# EAGLE design scc (EAGLE 7.2.0)
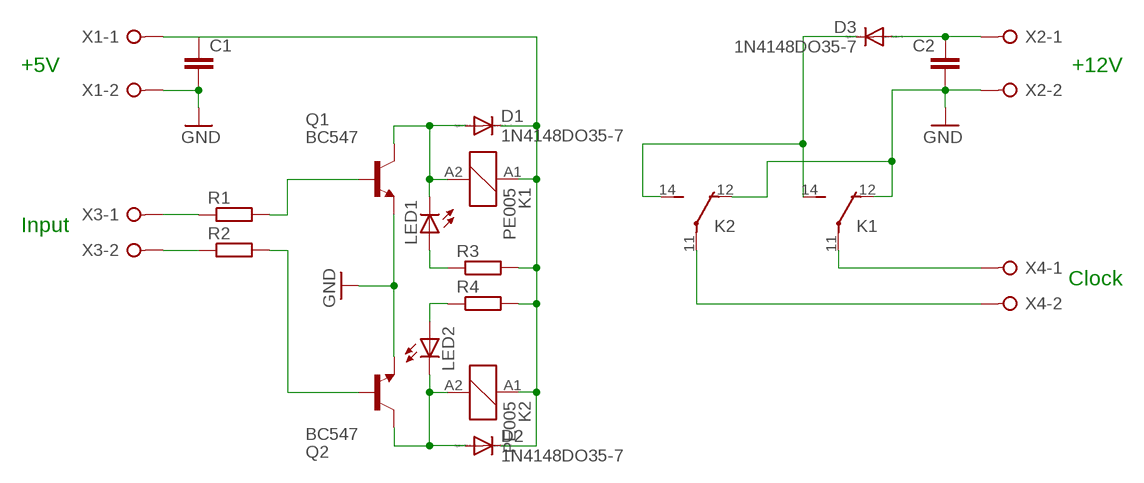
[diagram p0: schematic, sheet 1]

## Parts
C1  C-EU050-024X044  [C050-024X044]
C2  C-EU050-024X044  [C050-024X044]
D1  1N4148DO35-7  [DO35-7]
D2  1N4148DO35-7  [DO35-7]
D3  1N4148DO35-7  [DO35-7]
K1  PE005  [PE]
K2  PE005  [PE]
LED1  LED3MM  [LED3MM]
LED2  LED3MM  [LED3MM]
Q1  BC547  [TO92]
Q2  BC547  [TO92]
R1  R-EU_0204/7  [0204/7]
R2  R-EU_0204/7  [0204/7]
R3  R-EU_0204/7  [0204/7]
R4  R-EU_0204/7  [0204/7]
X1  W237-02P  [W237-132]
X2  W237-02P  [W237-132]
X3  W237-02P  [W237-132]
X4  W237-02P  [W237-132]

## Nets
GND: C1.2 C2.2 K1.12(2:O) K2.12(2:O) Q1.1(E) Q2.1(E) X1.2 X2.2
N$1: C2.1 D3.A X2.1
N$2: R1.1 X3.1
N$3: K1.11(2:P) X4.1
N$4: R2.1 X3.2
N$5: K2.11(2:P) X4.2
N$6: Q1.2(B) R1.2
N$7: D1.A K1.A2 LED1.K(C) Q1.3(C)
N$8: D2.A K2.A2 LED2.K(C) Q2.3(C)
N$9: C1.1 D1.C D2.C K1.A1 K2.A1 R3.2 R4.2 X1.1
N$10: LED1.A R3.1
N$11: Q2.2(B) R2.2
N$12: D3.C K1.14(2:S) K2.14(2:S)
N$13: LED2.A R4.1

## Notes on the sheet
- +5V | +12V
- Input
- Clock

## Library data of the parts
C1 C2 = rcl:C-EU: CAPACITOR, European symbol
D1-D3 = diode:1N4148: DIODE high speed (Philips)
K1 K2 = relay:PE*: Miniature PCB Relay 1 pole 5 A SCHRACK Source: http://www.schrack.com/.. 5807.pdf Miniature PCB Relay bistable 1pole 5 A, polarized bistable version Source: http://www.schrack.com/.. 5808.pdf; OC_FARNELL: unknown; OC_NEWARK: unknown
LED1 LED2 = led:LED: LED OSRAM: - CHIPLED LG R971, LG N971, LY N971, LG Q971, LY Q971, LO R971, LY R971 LH N974, LH R974 LS Q976, LO Q976, LY Q976 LO Q996 - Hyper CHIPLED LW Q18S LB Q993, LB Q99A, LB R99A - SideLED LS A670, LO A670, LY A670, LG A670, LP A670 LB A673, LV A673, LT A673, LW A673 LH A674 LY A675 LS A676, LA A676, LO A676, LY A676, LW A676 LS A679, LY A679, LG A679 - Hyper Micro SIDELED® LS Y876, LA Y876, LO Y876, LY Y876 LT Y87S - SmartLED LW L88C, LW L88S LB L89C, LB L89S, LG L890 LS L89K, LO L89K, LY L89K LS L896, LA L896, LO L896, LY L896 - TOPLED LS T670, LO T670, LY T670, LG T670, LP T670 LSG T670, LSP T670, LSY T670, LOP T670, LYG T670 LG T671, LOG T671, LSG T671 LB T673, LV T673, LT T673, LW T673 LH T674 LS T676, LA T676, LO T676, LY T676, LB T676, LH T676, LSB T676, LW T676 LB T67C, LV T67C, LT T67C, LS T67K, LO T67K, LY T67K, LW E67C LS E67B, LA E67B, LO E67B, LY E67B, LB E67C, LV E67C, LT E67C LW T67C LS T679, LY T679, LG T679 LS T770, LO T770, LY T770, LG T770, LP T770 LB T773, LV T773, LT T773, LW T773 LH T774 LS E675, LA E675, LY E675, LS T675 LS T776, LA T776, LO T776, LY T776, LB T776 LHGB T686 LT T68C, LB T68C - Hyper Mini TOPLED® LB M676 - Mini TOPLED Santana® LG M470 LS M47K, LO M47K, LY M47K Source: http://www.osram.convergy.de LUXEON: - LUMILED® LXK2-PW12-R00, LXK2-PW12-S00, LXK2-PW14-U00, LXK2-PW14-V00 LXK2-PM12-R00, LXK2-PM12-S00, LXK2-PM14-U00 LXK2-PE12-Q00, LXK2-PE12-R00, LXK2-PE12-S00, LXK2-PE14-T00, LXK2-PE14-U00 LXK2-PB12-K00, LXK2-PB12-L00, LXK2-PB12-M00, LXK2-PB14-N00, LXK2-PB14-P00, LXK2-PB14-Q00 LXK2-PR12-L00, LXK2-PR12-M00, LXK2-PR14-Q00, LXK2-PR14-R00 LXK2-PD12-Q00, LXK2-PD12-R00, LXK2-PD12-S00 LXK2-PH12-R00, LXK2-PH12-S00 LXK2-PL12-P00, LXK2-PL12-Q00, LXK2-PL12-R00 Source: www.luxeon.com KINGBRIGHT: KA-3528ASYC Source: www.kingbright.com
Q1 Q2 = transistor-npn:BC547*: NPN Transistor
R1-R4 = rcl:R-EU_: RESISTOR, European symbol
X1-X4 = con-wago-508:W237-02P: WAGO SREW CLAMP; OC_FARNELL: unknown; OC_NEWARK: unknown

## Board
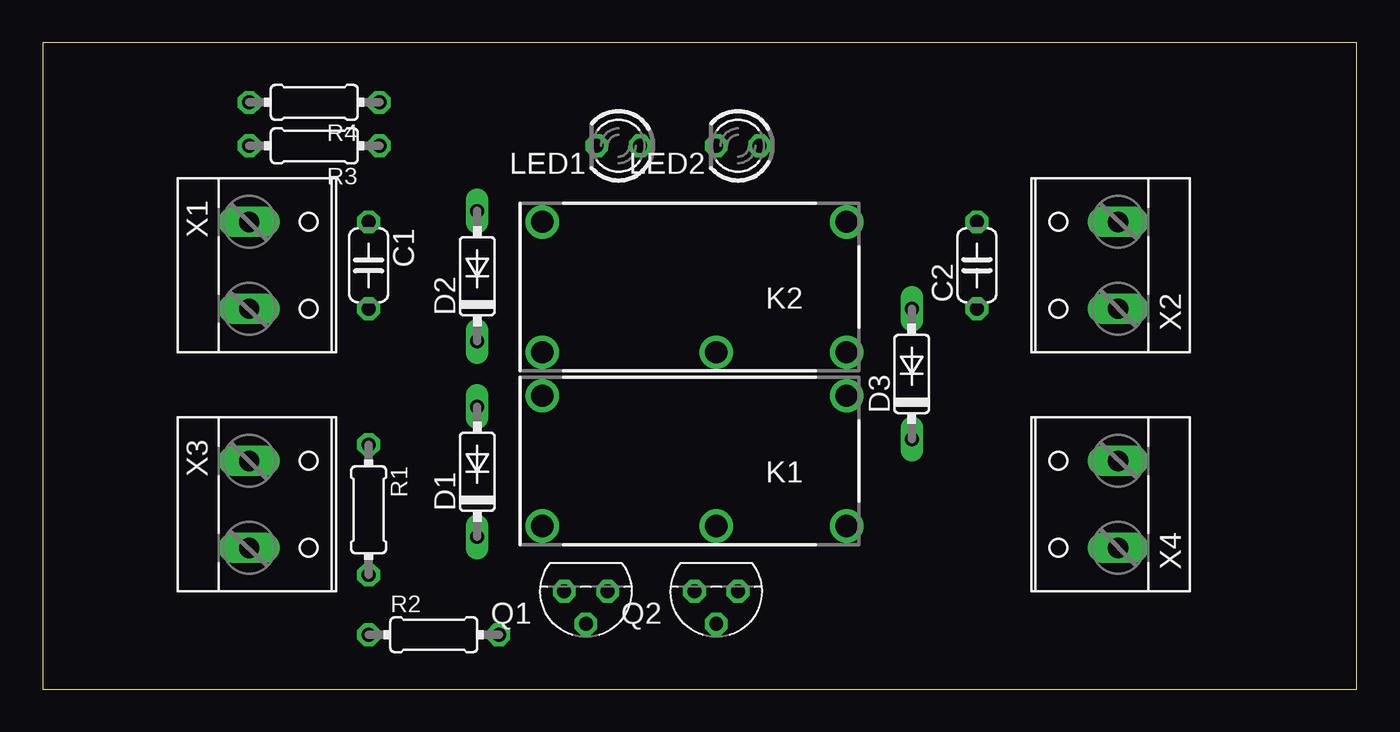
[diagram p1: board, top side]
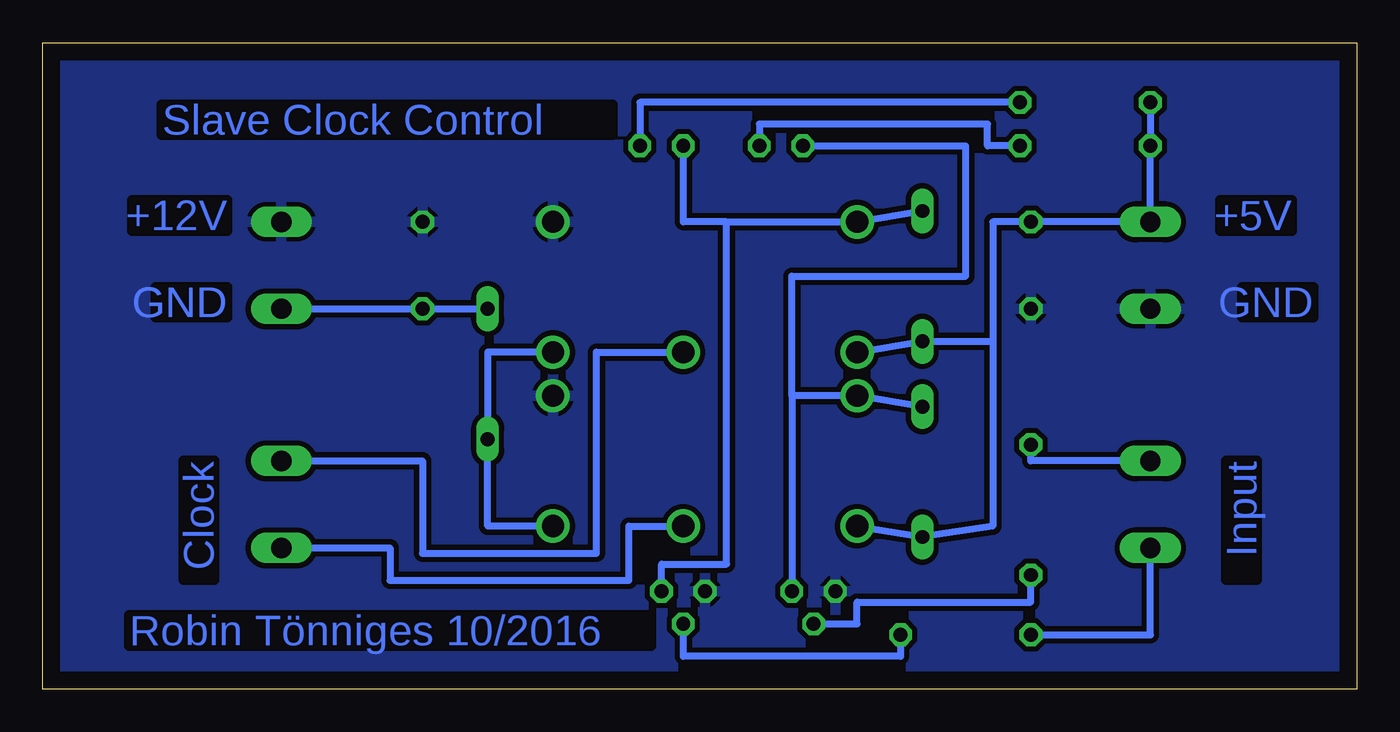
[diagram p2: board, bottom side, seen from below]

Size 76.81 x 37.77 mm. Coordinates in mm from the lower left corner, seen from the top.
Outline: 0,0 76.81,0 76.81,37.77 0,37.77 0,0
Copper layers (1*16): Top 0.035mm / dielectric 1.5mm / Bottom 0.035mm
Design rules "default": minimum track width 10mil, minimum drill 24mil, track to track 8mil, track to pad 8mil, pad to pad 8mil, via to via 8mil, smd to smd 8mil, copper to edge 40mil, drill to drill 8mil, minimum pad ring 10mil, minimum via ring 8mil, stop-mask expansion 4mil, vias tented up to drill 0mil, thermal gap 10mil

### Footprints (pad centres in the part's own frame; a part is rotated, then mirrored left to right if it is on the bottom)
C050-024X044 = drill 0.813 octagon: 1 -2.54,0; 2 2.54,0
DO35-7 = drill 0.813 long: A 3.81,0; C -3.81,0
PE = drill 1.3: 11 -1.27,3.81; 12 -8.89,-3.81; 14 -8.89,3.81; A1 8.89,3.81; A2 8.89,-3.81
LED3MM = drill 0.813 octagon: A -1.27,0; K 1.27,0
TO92 = drill 0.813 octagon: 1 1.27,0; 2 0,1.905; 3 -1.27,0
0204/7 = drill 0.813 octagon: 1 -3.81,0; 2 3.81,0
W237-132 = drill 1.194 long: 1 -2.54,-0.635; 2 2.54,-0.635

### Placement (x,y rotation side)
C1  19.05,24.77 270 top
C2  54.61,24.77 90 top
D1  25.4,12.7 90 top
D2  25.4,24.13 90 top
D3  50.8,18.41 90 top
K1  38.1,13.33 180 top
K2  38.1,23.49 180 top
LED1  33.66,31.75 180 top
LED2  40.64,31.75 180 top
Q1  31.75,5.71 180 top
Q2  39.37,5.71 180 top
R1  19.05,10.48 270 top
R2  22.86,3.17 0 top
R3  15.88,31.75 180 top
R4  15.88,34.29 180 top
X1  12.7,24.77 270 top
X2  62.23,24.77 90 top
X3  12.7,10.8 270 top
X4  62.23,10.8 90 top

### Tracks (layer width: path | path; a pad name or v marks a point on that pad's centre or on a via)
GND
  pour Bottom (isolate 0.305): 0.64,37.46 0,0.63 76.2,0.63 76.2,37.46
N$1
  Bottom 0.406: X2.1 C2.1 D3.A
N$2
  Bottom 0.406: X3.1 19.05,13.33 R1.1
N$3
  Bottom 0.406: X4.1 56.52,8.25 56.52,6.35 42.55,6.35 42.55,9.52 K1.11
N$4
  Bottom 0.406: R2.1 12.06,3.17 X3.2
N$5
  Bottom 0.406: X4.2 54.61,13.33 54.61,7.94 44.45,7.94 44.45,19.68 K2.11
N$6
  Bottom 0.406: Q1.2 29.21,3.81 29.21,5.08 19.05,5.08 R1.2
N$7
  Bottom 0.406: D1.A K1.A2 33.02,17.14 | 33.02,17.14 Q1.3 | 33.02,17.14 33.02,24.13 22.86,24.13 22.86,31.75 LED1.K
N$8
  Bottom 0.406: D2.A K2.A2 36.83,27.3 | Q2.3 40.64,7.3 36.83,7.3 36.83,27.3 | 36.83,27.3 39.37,27.3 LED2.K
N$9
  Bottom 0.406: K1.A1 D1.C 21.27,9.52 21.27,20.32 | K2.A1 D2.C 21.27,20.32 | 21.27,20.32 21.27,27.3 C1.1 X1.1 R3.2 R4.2
N$10
  Bottom 0.406: R3.1 21.59,31.75 21.59,33.02 34.92,33.02 LED1.A
N$11
  Bottom 0.406: R2.2 26.67,1.91 39.37,1.91 Q2.2
N$12
  Bottom 0.406: K2.14 50.8,19.68 D3.C 50.8,9.52 K1.14
N$13
  Bottom 0.406: R4.1 41.91,34.29 LED2.A

### Text on the board
Bottom: Slave Clock Control | +5V | +12V | GND | GND | GND | Input | Clock | Robin Tönniges 10/2016